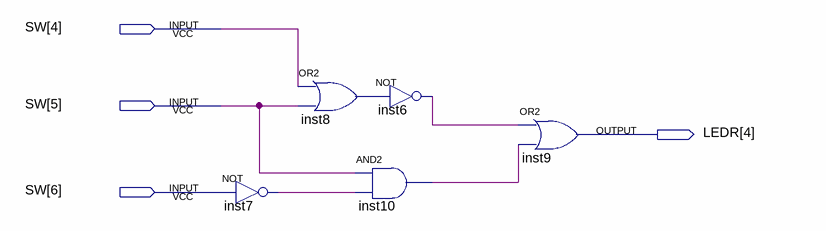
[diagram p0: schematic sheet]
// Quartus schematic Block2.bdf as structural Verilog: 5 symbols, 4 pins
module Block2 (
  input  [6:4] SW,
  output [4:4] LEDR
);

  wire inst6_out, inst7_out, inst8_out, inst10_out;

  not inst7 (inst7_out, SW[6]);
  or inst8 (inst8_out, SW[4], SW[5]);
  not inst6 (inst6_out, inst8_out);
  and inst10 (inst10_out, SW[5], inst7_out);
  or inst9 (LEDR[4], inst6_out, inst10_out);
endmodule
